# Altium project HighSpeedSoM_Project.PrjPcb
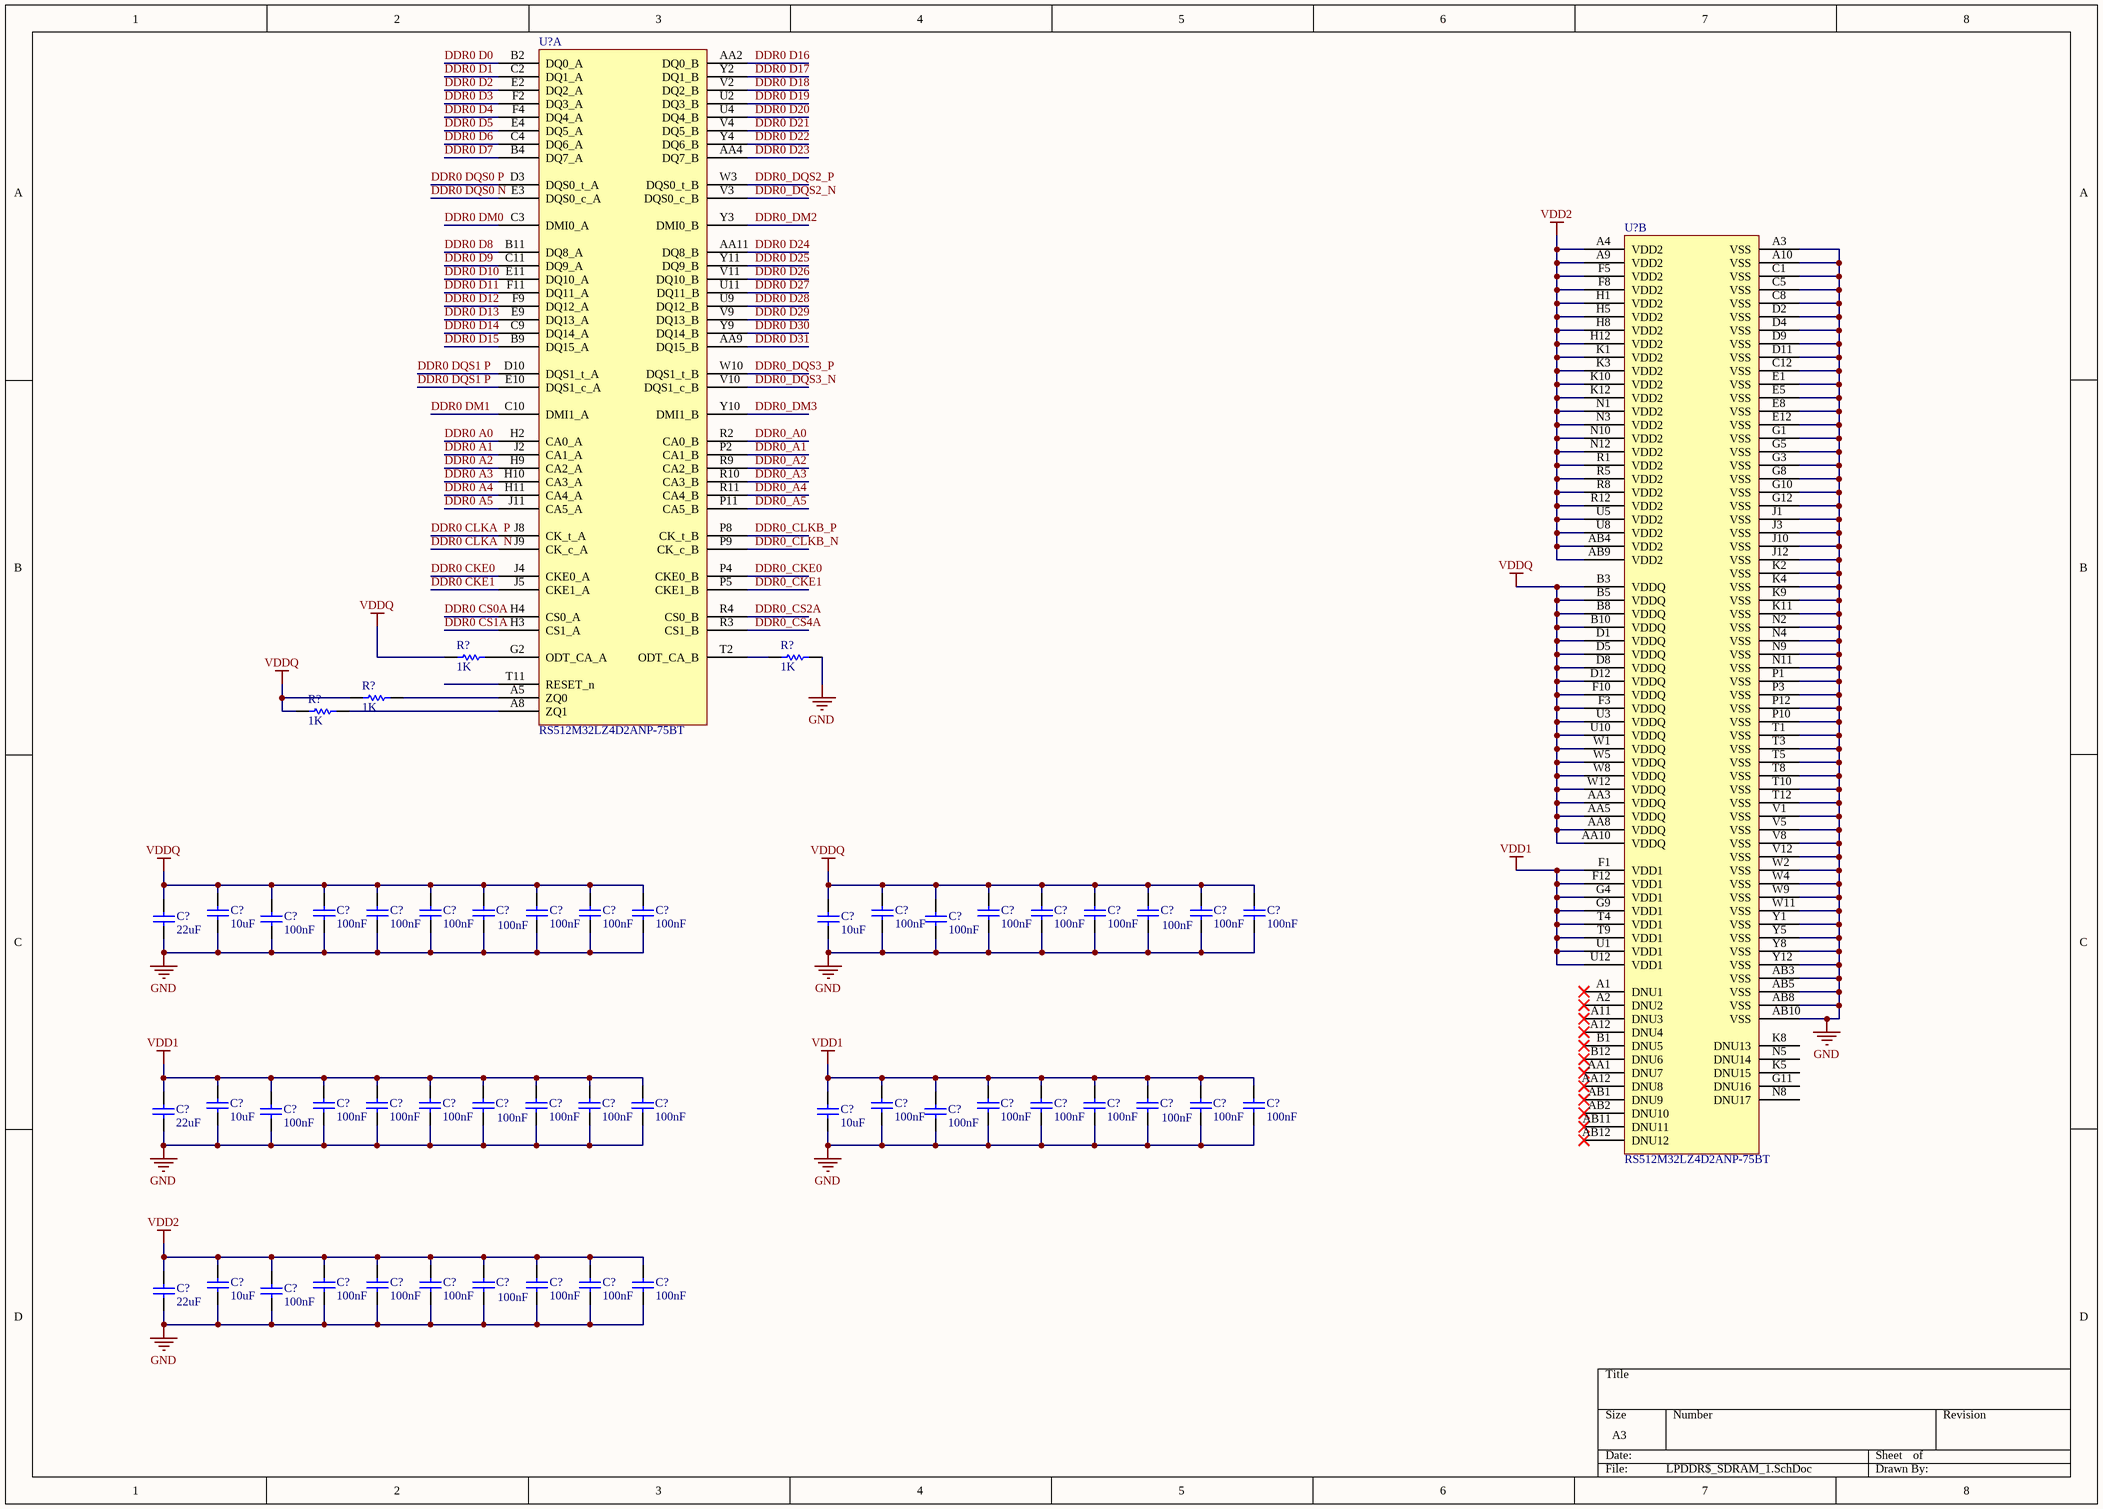
[diagram p0: LPDDR$_SDRAM_1.SchDoc]
3 sheets, 70 parts. Net scope: global (net labels, ports and power ports of the same name join across sheets).
Sheets:
  LPDDR$_SDRAM_1.SchDoc
  RK3399 SDRAM Page.SchDoc
  Block Diagram of SOM.SchDoc

## Sheet LPDDR$_SDRAM_1.SchDoc
size A3; SheetNumber: 1; SheetTotal: 6

### Parts
(Parts that share a designator on the sheet are numbered #1, #2 ... from top to bottom, then left to right.)
C?#1  value 10uF  (hidden comment: Capacitor)
C?#2  value 100nF  (hidden comment: Capacitor)
C?#3  value 100nF  (hidden comment: Capacitor)
C?#4  value 100nF  (hidden comment: Capacitor)
C?#5  value 100nF  (hidden comment: Capacitor)
C?#6  value 100nF  (hidden comment: Capacitor)
C?#7  value 100nF  (hidden comment: Capacitor)
C?#8  value 100nF  (hidden comment: Capacitor)
C?#9  value 100nF  (hidden comment: Capacitor)
C?#10  value 100nF  (hidden comment: Capacitor)
C?#11  value 100nF  (hidden comment: Capacitor)
C?#12  value 100nF  (hidden comment: Capacitor)
C?#13  value 100nF  (hidden comment: Capacitor)
C?#14  value 100nF  (hidden comment: Capacitor)
C?#15  value 100nF  (hidden comment: Capacitor)
C?#16  value 22uF  (hidden comment: Capacitor)
C?#17  value 100nF  (hidden comment: Capacitor)
C?#18  value 10uF  (hidden comment: Capacitor)
C?#19  value 100nF  (hidden comment: Capacitor)
C?#20  value 10uF  (hidden comment: Capacitor)
C?#21  value 100nF  (hidden comment: Capacitor)
C?#22  value 100nF  (hidden comment: Capacitor)
C?#23  value 100nF  (hidden comment: Capacitor)
C?#24  value 100nF  (hidden comment: Capacitor)
C?#25  value 100nF  (hidden comment: Capacitor)
C?#26  value 100nF  (hidden comment: Capacitor)
C?#27  value 100nF  (hidden comment: Capacitor)
C?#28  value 100nF  (hidden comment: Capacitor)
C?#29  value 100nF  (hidden comment: Capacitor)
C?#30  value 100nF  (hidden comment: Capacitor)
C?#31  value 100nF  (hidden comment: Capacitor)
C?#32  value 100nF  (hidden comment: Capacitor)
C?#33  value 100nF  (hidden comment: Capacitor)
C?#34  value 100nF  (hidden comment: Capacitor)
C?#35  value 22uF  (hidden comment: Capacitor)
C?#36  value 100nF  (hidden comment: Capacitor)
C?#37  value 10uF  (hidden comment: Capacitor)
C?#38  value 100nF  (hidden comment: Capacitor)
C?#39  value 22uF  (hidden comment: Capacitor)
C?#40  value 10uF  (hidden comment: Capacitor)
C?#41  value 100nF  (hidden comment: Capacitor)
C?#42  value 100nF  (hidden comment: Capacitor)
C?#43  value 100nF  (hidden comment: Capacitor)
C?#44  value 100nF  (hidden comment: Capacitor)
C?#45  value 100nF  (hidden comment: Capacitor)
C?#46  value 100nF  (hidden comment: Capacitor)
C?#47  value 100nF  (hidden comment: Capacitor)
C?#48  value 100nF  (hidden comment: Capacitor)
R?#1  value 1K  (hidden comment: Resistor)
R?#2  value 1K  (hidden comment: Resistor)
R?#3  value 1K  (hidden comment: Resistor)
R?#4  value 1K  (hidden comment: Resistor)
U?#1  RS512M32LZ4D2ANP-75BT  [FBGA200_SMD]  (part A of 2)
U?#2  RS512M32LZ4D2ANP-75BT  [FBGA200_SMD]  (part B of 2)

### Nets
GND: C?#1.1 C?#2.1 C?#3.1 C?#4.1 C?#5.1 C?#6.1 C?#7.1 C?#8.1 C?#9.1 C?#10.1 C?#11.1 C?#12.1 C?#13.1 C?#14.1 C?#15.1 C?#16.1 C?#17.1 C?#18.1 C?#19.1 C?#20.1 C?#21.1 C?#22.1 C?#23.1 C?#24.1 C?#25.1 C?#26.1 C?#27.1 C?#28.1 C?#29.1 C?#30.1 C?#31.1 C?#32.1 C?#33.1 C?#34.1 C?#35.1 C?#36.1 C?#37.1 C?#38.1 C?#39.1 C?#40.1 C?#41.1 C?#42.1 C?#43.1 C?#44.1 C?#45.1 C?#46.1 C?#47.1 C?#48.1 R?#2.2 U?#2.A3(VSS) U?#2.A10(VSS) U?#2.AB3(VSS) U?#2.AB5(VSS) U?#2.AB8(VSS) U?#2.AB10(VSS) U?#2.C1(VSS) U?#2.C5(VSS) U?#2.C8(VSS) U?#2.C12(VSS) U?#2.D2(VSS) U?#2.D4(VSS) U?#2.D9(VSS) U?#2.D11(VSS) U?#2.E1(VSS) U?#2.E5(VSS) U?#2.E8(VSS) U?#2.E12(VSS) U?#2.G1(VSS) U?#2.G3(VSS) U?#2.G5(VSS) U?#2.G8(VSS) U?#2.G10(VSS) U?#2.G12(VSS) U?#2.J1(VSS) U?#2.J3(VSS) U?#2.J10(VSS) U?#2.J12(VSS) U?#2.K2(VSS) U?#2.K4(VSS) U?#2.K9(VSS) U?#2.K11(VSS) U?#2.N2(VSS) U?#2.N4(VSS) U?#2.N9(VSS) U?#2.N11(VSS) U?#2.P1(VSS) U?#2.P3(VSS) U?#2.P10(VSS) U?#2.P12(VSS) U?#2.T1(VSS) U?#2.T3(VSS) U?#2.T5(VSS) U?#2.T8(VSS) U?#2.T10(VSS) U?#2.T12(VSS) U?#2.V1(VSS) U?#2.V5(VSS) U?#2.V8(VSS) U?#2.V12(VSS) U?#2.W2(VSS) U?#2.W4(VSS) U?#2.W9(VSS) U?#2.W11(VSS) U?#2.Y1(VSS) U?#2.Y5(VSS) U?#2.Y8(VSS) U?#2.Y12(VSS)
VDD1: C?#20.2 C?#21.2 C?#22.2 C?#23.2 C?#24.2 C?#25.2 C?#26.2 C?#27.2 C?#28.2 C?#29.2 C?#30.2 C?#31.2 C?#32.2 C?#33.2 C?#34.2 C?#35.2 C?#36.2 C?#37.2 C?#38.2 U?#2.F1(VDD1) U?#2.F12(VDD1) U?#2.G4(VDD1) U?#2.G9(VDD1) U?#2.T4(VDD1) U?#2.T9(VDD1) U?#2.U1(VDD1) U?#2.U12(VDD1)
VDD2: C?#39.2 C?#40.2 C?#41.2 C?#42.2 C?#43.2 C?#44.2 C?#45.2 C?#46.2 C?#47.2 C?#48.2 U?#2.A4(VDD2) U?#2.A9(VDD2) U?#2.AB4(VDD2) U?#2.AB9(VDD2) U?#2.F5(VDD2) U?#2.F8(VDD2) U?#2.H1(VDD2) U?#2.H5(VDD2) U?#2.H8(VDD2) U?#2.H12(VDD2) U?#2.K1(VDD2) U?#2.K3(VDD2) U?#2.K10(VDD2) U?#2.K12(VDD2) U?#2.N1(VDD2) U?#2.N3(VDD2) U?#2.N10(VDD2) U?#2.N12(VDD2) U?#2.R1(VDD2) U?#2.R5(VDD2) U?#2.R8(VDD2) U?#2.R12(VDD2) U?#2.U5(VDD2) U?#2.U8(VDD2)
VDDQ: C?#1.2 C?#2.2 C?#3.2 C?#4.2 C?#5.2 C?#6.2 C?#7.2 C?#8.2 C?#9.2 C?#10.2 C?#11.2 C?#12.2 C?#13.2 C?#14.2 C?#15.2 C?#16.2 C?#17.2 C?#18.2 C?#19.2 R?#1.1 R?#3.1 R?#4.1 U?#2.AA3(VDDQ) U?#2.AA5(VDDQ) U?#2.AA8(VDDQ) U?#2.AA10(VDDQ) U?#2.B3(VDDQ) U?#2.B5(VDDQ) U?#2.B8(VDDQ) U?#2.B10(VDDQ) U?#2.D1(VDDQ) U?#2.D5(VDDQ) U?#2.D8(VDDQ) U?#2.D12(VDDQ) U?#2.F3(VDDQ) U?#2.F10(VDDQ) U?#2.U3(VDDQ) U?#2.U10(VDDQ) U?#2.W1(VDDQ) U?#2.W5(VDDQ) U?#2.W8(VDDQ) U?#2.W12(VDDQ)
DDR0 A0: U?#1.H2(CA0_A)
DDR0 A1: U?#1.J2(CA1_A)
DDR0 A2: U?#1.H9(CA2_A)
DDR0 A3: U?#1.H10(CA3_A)
DDR0 A4: U?#1.H11(CA4_A)
DDR0 A5: U?#1.J11(CA5_A)
DDR0 CKE0: U?#1.J4(CKE0_A)
DDR0 CKE1: U?#1.J5(CKE1_A)
DDR0 CLKA  N: U?#1.J9(CK_c_A)
DDR0 CLKA  P: U?#1.J8(CK_t_A)
DDR0 CS0A: U?#1.H4(CS0_A)
DDR0 CS1A: U?#1.H3(CS1_A)
DDR0 D0: U?#1.B2(DQ0_A)
DDR0 D1: U?#1.C2(DQ1_A)
DDR0 D2: U?#1.E2(DQ2_A)
DDR0 D3: U?#1.F2(DQ3_A)
DDR0 D4: U?#1.F4(DQ4_A)
DDR0 D5: U?#1.E4(DQ5_A)
DDR0 D6: U?#1.C4(DQ6_A)
DDR0 D7: U?#1.B4(DQ7_A)
DDR0 D8: U?#1.B11(DQ8_A)
DDR0 D9: U?#1.C11(DQ9_A)
DDR0 D10: U?#1.E11(DQ10_A)
DDR0 D11: U?#1.F11(DQ11_A)
DDR0 D12: U?#1.F9(DQ12_A)
DDR0 D13: U?#1.E9(DQ13_A)
DDR0 D14: U?#1.C9(DQ14_A)
DDR0 D15: U?#1.B9(DQ15_A)
DDR0 D16: U?#1.AA2(DQ0_B)
DDR0 D17: U?#1.Y2(DQ1_B)
DDR0 D18: U?#1.V2(DQ2_B)
DDR0 D19: U?#1.U2(DQ3_B)
DDR0 D20: U?#1.U4(DQ4_B)
DDR0 D21: U?#1.V4(DQ5_B)
DDR0 D22: U?#1.Y4(DQ6_B)
DDR0 D23: U?#1.AA4(DQ7_B)
DDR0 D24: U?#1.AA11(DQ8_B)
DDR0 D25: U?#1.Y11(DQ9_B)
DDR0 D26: U?#1.V11(DQ10_B)
DDR0 D27: U?#1.U11(DQ11_B)
DDR0 D28: U?#1.U9(DQ12_B)
DDR0 D29: U?#1.V9(DQ13_B)
DDR0 D30: U?#1.Y9(DQ14_B)
DDR0 D31: U?#1.AA9(DQ15_B)
DDR0 DM0: U?#1.C3(DMI0_A)
DDR0 DM1: U?#1.C10(DMI1_A)
DDR0 DQS0 N: U?#1.E3(DQS0_c_A)
DDR0 DQS0 P: U?#1.D3(DQS0_t_A)
DDR0 DQS1 P: U?#1.D10(DQS1_t_A) U?#1.E10(DQS1_c_A)
DDR0_A0: U?#1.R2(CA0_B)
DDR0_A1: U?#1.P2(CA1_B)
DDR0_A2: U?#1.R9(CA2_B)
DDR0_A3: U?#1.R10(CA3_B)
DDR0_A4: U?#1.R11(CA4_B)
DDR0_A5: U?#1.P11(CA5_B)
DDR0_CKE0: U?#1.P4(CKE0_B)
DDR0_CKE1: U?#1.P5(CKE1_B)
DDR0_CLKB_N: U?#1.P9(CK_c_B)
DDR0_CLKB_P: U?#1.P8(CK_t_B)
DDR0_CS2A: U?#1.R4(CS0_B)
DDR0_CS4A: U?#1.R3(CS1_B)
DDR0_DM2: U?#1.Y3(DMI0_B)
DDR0_DM3: U?#1.Y10(DMI1_B)
DDR0_DQS2_N: U?#1.V3(DQS0_c_B)
DDR0_DQS2_P: U?#1.W3(DQS0_t_B)
DDR0_DQS3_N: U?#1.V10(DQS1_c_B)
DDR0_DQS3_P: U?#1.W10(DQS1_t_B)
NetR?#1_2: R?#1.2 U?#1.G2(ODT_CA_A)
NetR?#2_1: R?#2.1 U?#1.T2(ODT_CA_B)
NetR?#3_2: R?#3.2 U?#1.A5(ZQ0)
NetR?#4_2: R?#4.2 U?#1.A8(ZQ1)

Not connected (* = marked no-connect by the designer): U?#1 T11(RESET_n); U?#2 A1(DNU1)* A2(DNU2)* A11(DNU3)* A12(DNU4)* AA1(DNU7)* AA12(DNU8)* AB1(DNU9)* AB2(DNU10)* AB11(DNU11)* AB12(DNU12)* B1(DNU5)* B12(DNU6)* G11(DNU16) K5(DNU15) K8(DNU13) N5(DNU14) N8(DNU17)

### Library data of the parts
C?#1-C?#48 = Capacitor: SimulationGenericComponent: True
R?#1-R?#4 = Resistor: TC1: 0; SimulationGenericComponent: True; TC2: 0
U?#1 U?#2 = IC_RS512M32LZ4D2ANP-75BT: LPDDR4/4X Package FBGA 200b Density 4Gbit~64Gbit Operating Temperature Range：-25~85℃ Speed：2667Mbps/3200Mbps/3733Mbps Voltage：VDD1/VDD2/VDDQ= 1.8 / 1.1 / 1.1 V（LPDDR4）VDD1/VDD2/VDDQ = 1.8 / 1.1 / 0.6 V（LPDDR4X）Approved Verification Platform：MTK、Spreadtrum; Manufacturer: RAYSON; Manufacturer Part Number: RS512M32LZ4D2ANP-75BT; Case/Package: FBGA 200b; Supplier-1: RAYSON

## Sheet RK3399 SDRAM Page.SchDoc
size A3; SheetNumber: 6; SheetTotal: 7
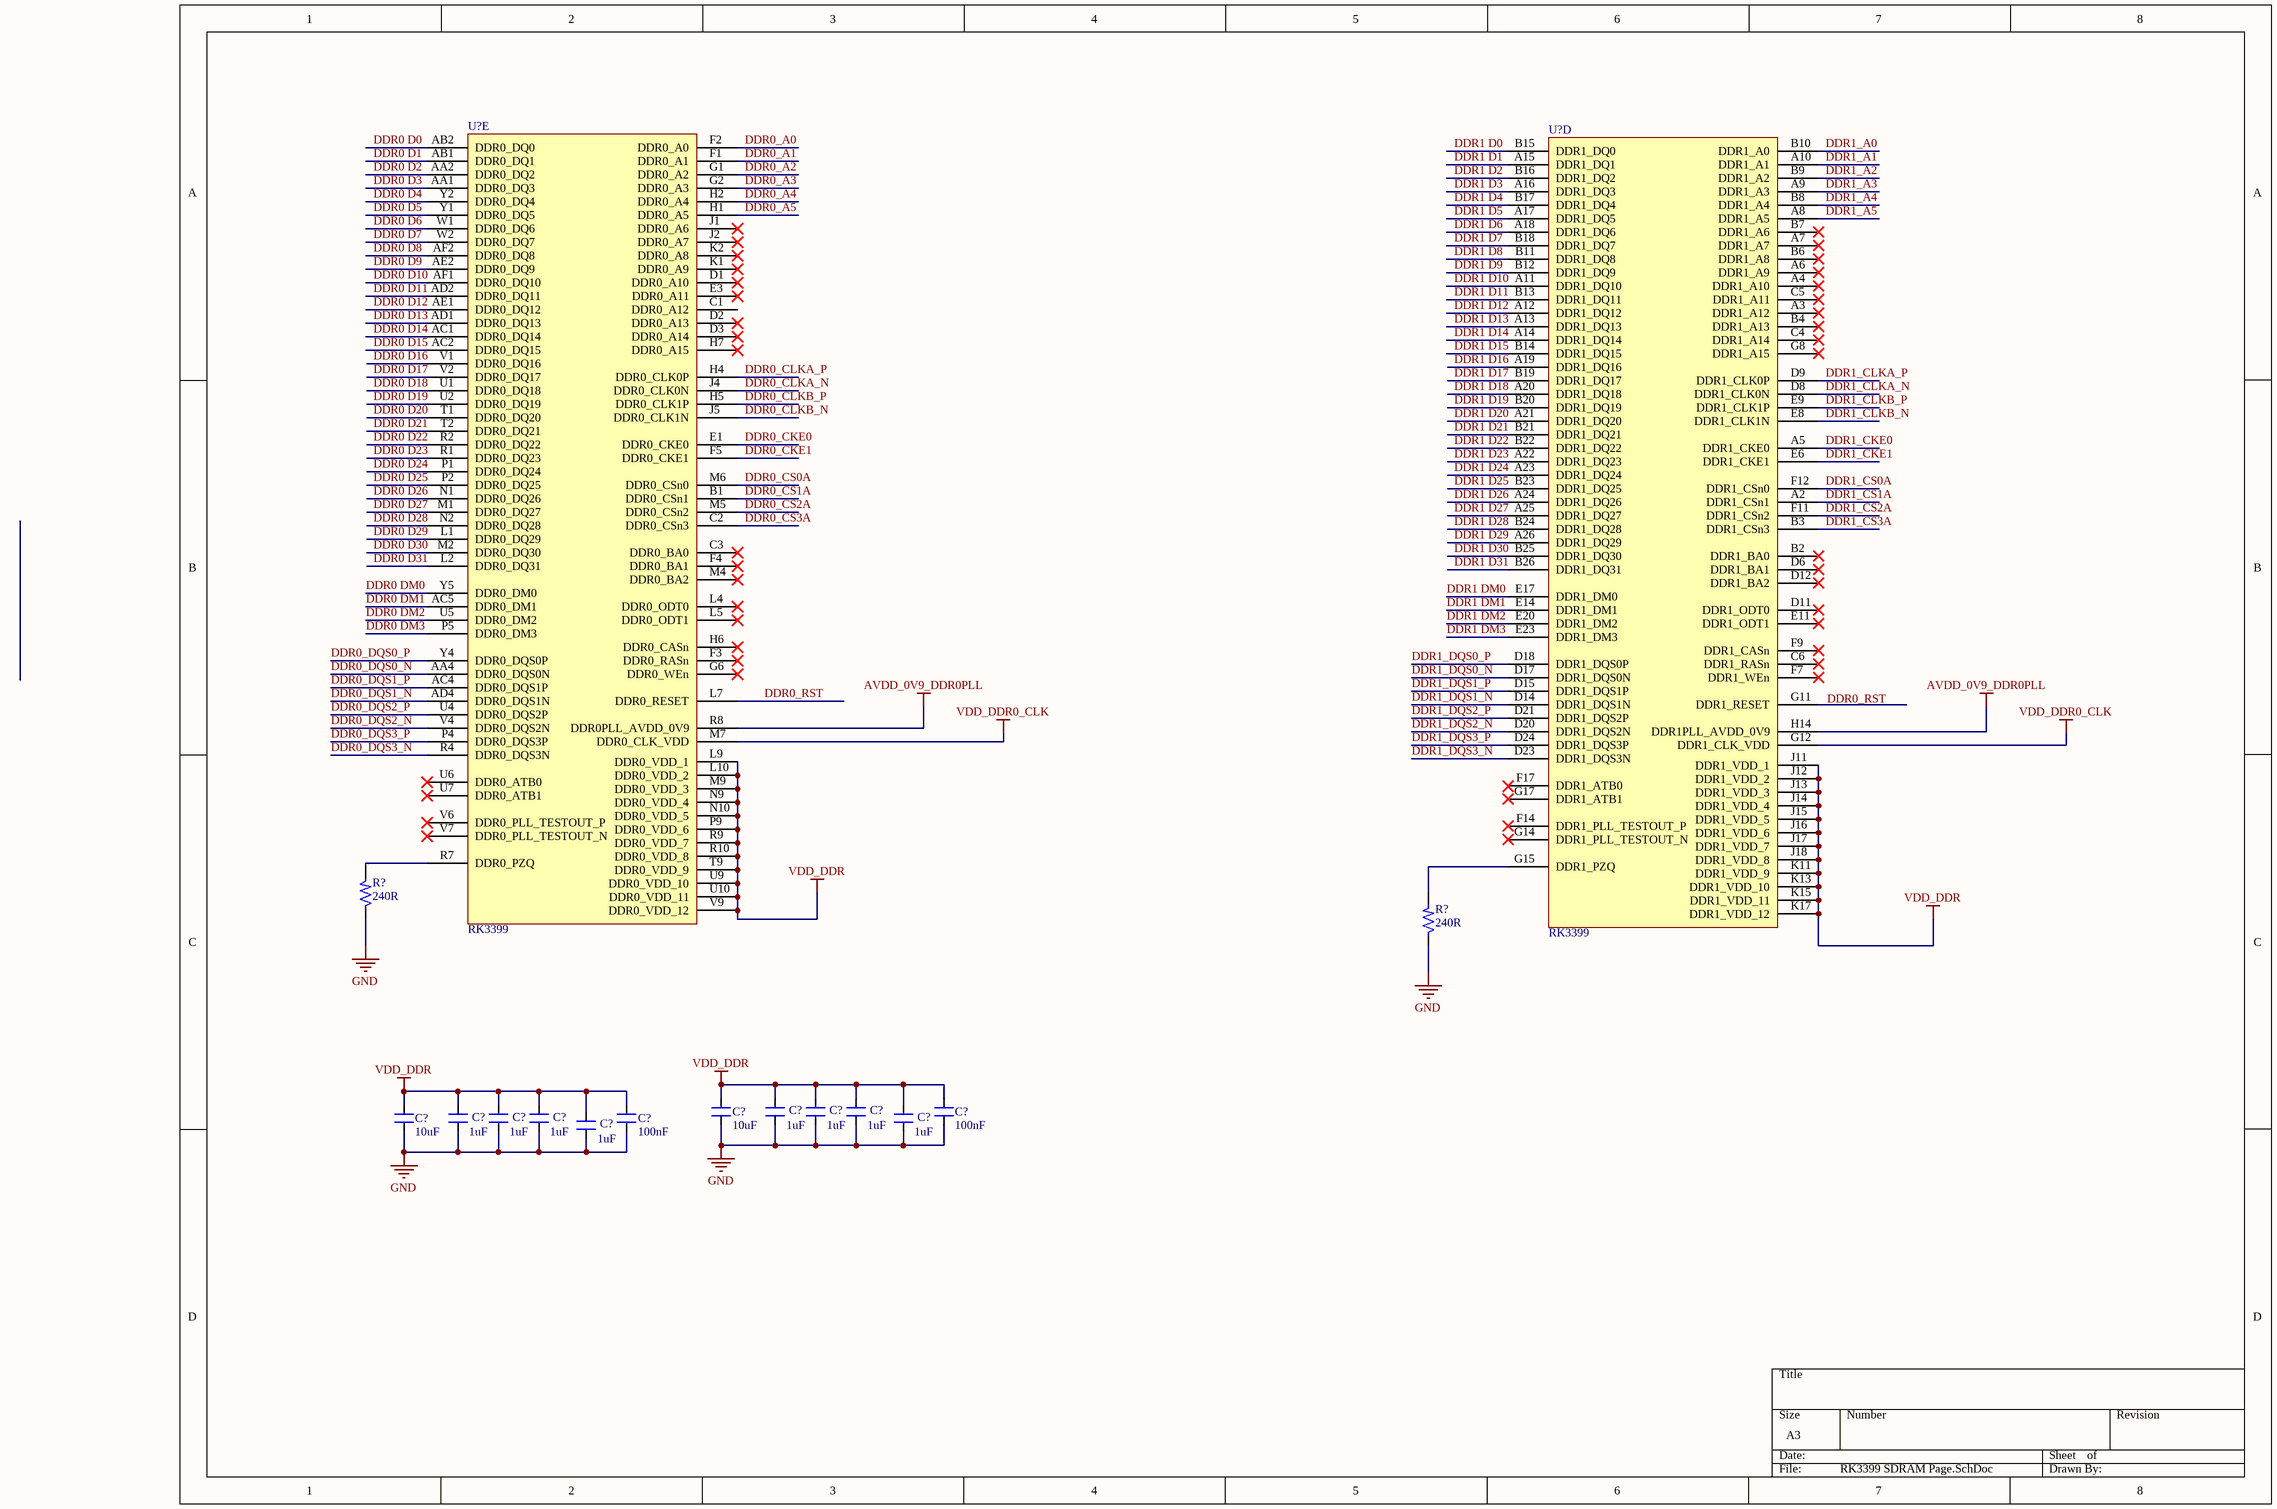
[diagram p1: RK3399 SDRAM Page.SchDoc]

### Parts
(Parts that share a designator on the sheet are numbered #1, #2 ... from top to bottom, then left to right.)
C?#49  10uF  [CAP_0603]
C?#50  1uF  [CAP_0402]
C?#51  1uF  [CAP_0402]
C?#52  1uF  [CAP_0402]
C?#53  100nF  [CAP_0201]
C?#54  10uF  [CAP_0603]
C?#55  1uF  [CAP_0402]
C?#56  1uF  [CAP_0402]
C?#57  1uF  [CAP_0402]
C?#58  100nF  [CAP_0201]
C?#59  1uF  [CAP_0402]
C?#60  1uF  [CAP_0402]
R?#5  240R  [RES_0402]
R?#6  240R  [RES_0402]
U?#3  RK3399  [FBGA828_23_826X826]  (part E of 24)
U?#4  RK3399  [FBGA828_23_826X826]  (part D of 24)

### Nets
AVDD_0V9_DDR0PLL: U?#3.R8(DDR0PLL_AVDD_0V9) U?#4.H14(DDR1PLL_AVDD_0V9)
GND: C?#49.1 C?#50.1 C?#51.1 C?#52.1 C?#53.1 C?#54.1 C?#55.1 C?#56.1 C?#57.1 C?#58.1 C?#59.1 C?#60.1 R?#5.1 R?#6.1
VDD_DDR: C?#49.2 C?#50.2 C?#51.2 C?#52.2 C?#53.2 C?#54.2 C?#55.2 C?#56.2 C?#57.2 C?#58.2 C?#59.2 C?#60.2 U?#3.L9(DDR0_VDD_1) U?#3.L10(DDR0_VDD_2) U?#3.M9(DDR0_VDD_3) U?#3.N9(DDR0_VDD_4) U?#3.N10(DDR0_VDD_5) U?#3.P9(DDR0_VDD_6) U?#3.R9(DDR0_VDD_7) U?#3.R10(DDR0_VDD_8) U?#3.T9(DDR0_VDD_9) U?#3.U9(DDR0_VDD_10) U?#3.U10(DDR0_VDD_11) U?#3.V9(DDR0_VDD_12) U?#4.J11(DDR1_VDD_1) U?#4.J12(DDR1_VDD_2) U?#4.J13(DDR1_VDD_3) U?#4.J14(DDR1_VDD_4) U?#4.J15(DDR1_VDD_5) U?#4.J16(DDR1_VDD_6) U?#4.J17(DDR1_VDD_7) U?#4.J18(DDR1_VDD_8) U?#4.K11(DDR1_VDD_9) U?#4.K13(DDR1_VDD_10) U?#4.K15(DDR1_VDD_11) U?#4.K17(DDR1_VDD_12)
VDD_DDR0_CLK: U?#3.M7(DDR0_CLK_VDD) U?#4.G12(DDR1_CLK_VDD)
DDR0 D0: U?#3.AB2(DDR0_DQ0)
DDR0 D1: U?#3.AB1(DDR0_DQ1)
DDR0 D2: U?#3.AA2(DDR0_DQ2)
DDR0 D3: U?#3.AA1(DDR0_DQ3)
DDR0 D4: U?#3.Y2(DDR0_DQ4)
DDR0 D5: U?#3.Y1(DDR0_DQ5)
DDR0 D6: U?#3.W1(DDR0_DQ6)
DDR0 D7: U?#3.W2(DDR0_DQ7)
DDR0 D8: U?#3.AF2(DDR0_DQ8)
DDR0 D9: U?#3.AE2(DDR0_DQ9)
DDR0 D10: U?#3.AF1(DDR0_DQ10)
DDR0 D11: U?#3.AD2(DDR0_DQ11)
DDR0 D12: U?#3.AE1(DDR0_DQ12)
DDR0 D13: U?#3.AD1(DDR0_DQ13)
DDR0 D14: U?#3.AC1(DDR0_DQ14)
DDR0 D15: U?#3.AC2(DDR0_DQ15)
DDR0 D16: U?#3.V1(DDR0_DQ16)
DDR0 D17: U?#3.V2(DDR0_DQ17)
DDR0 D18: U?#3.U1(DDR0_DQ18)
DDR0 D19: U?#3.U2(DDR0_DQ19)
DDR0 D20: U?#3.T1(DDR0_DQ20)
DDR0 D21: U?#3.T2(DDR0_DQ21)
DDR0 D22: U?#3.R2(DDR0_DQ22)
DDR0 D23: U?#3.R1(DDR0_DQ23)
DDR0 D24: U?#3.P1(DDR0_DQ24)
DDR0 D25: U?#3.P2(DDR0_DQ25)
DDR0 D26: U?#3.N1(DDR0_DQ26)
DDR0 D27: U?#3.M1(DDR0_DQ27)
DDR0 D28: U?#3.N2(DDR0_DQ28)
DDR0 D29: U?#3.L1(DDR0_DQ29)
DDR0 D30: U?#3.M2(DDR0_DQ30)
DDR0 D31: U?#3.L2(DDR0_DQ31)
DDR0 DM0: U?#3.Y5(DDR0_DM0)
DDR0 DM1: U?#3.AC5(DDR0_DM1)
DDR0 DM2: U?#3.U5(DDR0_DM2)
DDR0 DM3: U?#3.P5(DDR0_DM3)
DDR0_A0: U?#3.F2(DDR0_A0)
DDR0_A1: U?#3.F1(DDR0_A1)
DDR0_A2: U?#3.G1(DDR0_A2)
DDR0_A3: U?#3.G2(DDR0_A3)
DDR0_A4: U?#3.H2(DDR0_A4)
DDR0_A5: U?#3.H1(DDR0_A5)
DDR0_CKE0: U?#3.E1(DDR0_CKE0)
DDR0_CKE1: U?#3.F5(DDR0_CKE1)
DDR0_CLKA_N: U?#3.J4(DDR0_CLK0N)
DDR0_CLKA_P: U?#3.H4(DDR0_CLK0P)
DDR0_CLKB_N: U?#3.J5(DDR0_CLK1N)
DDR0_CLKB_P: U?#3.H5(DDR0_CLK1P)
DDR0_CS0A: U?#3.M6(DDR0_CSn0)
DDR0_CS1A: U?#3.B1(DDR0_CSn1)
DDR0_CS2A: U?#3.M5(DDR0_CSn2)
DDR0_CS3A: U?#3.C2(DDR0_CSn3)
DDR0_DQS0_N: U?#3.AA4(DDR0_DQS0N)
DDR0_DQS0_P: U?#3.Y4(DDR0_DQS0P)
DDR0_DQS1_N: U?#3.AD4(DDR0_DQS1N)
DDR0_DQS1_P: U?#3.AC4(DDR0_DQS1P)
DDR0_DQS2_N: U?#3.V4(DDR0_DQS2N)
DDR0_DQS2_P: U?#3.U4(DDR0_DQS2P)
DDR0_DQS3_N: U?#3.R4(DDR0_DQS3N)
DDR0_DQS3_P: U?#3.P4(DDR0_DQS3P)
DDR0_RST: U?#3.L7(DDR0_RESET)
DDR1 D0: U?#4.B15(DDR1_DQ0)
DDR1 D1: U?#4.A15(DDR1_DQ1)
DDR1 D2: U?#4.B16(DDR1_DQ2)
DDR1 D3: U?#4.A16(DDR1_DQ3)
DDR1 D4: U?#4.B17(DDR1_DQ4)
DDR1 D5: U?#4.A17(DDR1_DQ5)
DDR1 D6: U?#4.A18(DDR1_DQ6)
DDR1 D7: U?#4.B18(DDR1_DQ7)
DDR1 D8: U?#4.B11(DDR1_DQ8)
DDR1 D9: U?#4.B12(DDR1_DQ9)
DDR1 D10: U?#4.A11(DDR1_DQ10)
DDR1 D11: U?#4.B13(DDR1_DQ11)
DDR1 D12: U?#4.A12(DDR1_DQ12)
DDR1 D13: U?#4.A13(DDR1_DQ13)
DDR1 D14: U?#4.A14(DDR1_DQ14)
DDR1 D15: U?#4.B14(DDR1_DQ15)
DDR1 D16: U?#4.A19(DDR1_DQ16)
DDR1 D17: U?#4.B19(DDR1_DQ17)
DDR1 D18: U?#4.A20(DDR1_DQ18)
DDR1 D19: U?#4.B20(DDR1_DQ19)
DDR1 D20: U?#4.A21(DDR1_DQ20)
DDR1 D21: U?#4.B21(DDR1_DQ21)
DDR1 D22: U?#4.B22(DDR1_DQ22)
DDR1 D23: U?#4.A22(DDR1_DQ23)
DDR1 D24: U?#4.A23(DDR1_DQ24)
DDR1 D25: U?#4.B23(DDR1_DQ25)
DDR1 D26: U?#4.A24(DDR1_DQ26)
DDR1 D27: U?#4.A25(DDR1_DQ27)
DDR1 D28: U?#4.B24(DDR1_DQ28)
DDR1 D29: U?#4.A26(DDR1_DQ29)
DDR1 D30: U?#4.B25(DDR1_DQ30)
DDR1 D31: U?#4.B26(DDR1_DQ31)
DDR1 DM0: U?#4.E17(DDR1_DM0)
DDR1 DM1: U?#4.E14(DDR1_DM1)
DDR1 DM2: U?#4.E20(DDR1_DM2)
DDR1 DM3: U?#4.E23(DDR1_DM3)
DDR1_A0: U?#4.B10(DDR1_A0)
DDR1_A1: U?#4.A10(DDR1_A1)
DDR1_A2: U?#4.B9(DDR1_A2)
DDR1_A3: U?#4.A9(DDR1_A3)
DDR1_A4: U?#4.B8(DDR1_A4)
DDR1_A5: U?#4.A8(DDR1_A5)
DDR1_CKE0: U?#4.A5(DDR1_CKE0)
DDR1_CKE1: U?#4.E6(DDR1_CKE1)
DDR1_CLKA_N: U?#4.D8(DDR1_CLK0N)
DDR1_CLKA_P: U?#4.D9(DDR1_CLK0P)
DDR1_CLKB_N: U?#4.E8(DDR1_CLK1N)
DDR1_CLKB_P: U?#4.E9(DDR1_CLK1P)
DDR1_CS0A: U?#4.F12(DDR1_CSn0)
DDR1_CS1A: U?#4.A2(DDR1_CSn1)
DDR1_CS2A: U?#4.F11(DDR1_CSn2)
DDR1_CS3A: U?#4.B3(DDR1_CSn3)
DDR1_DQS0_N: U?#4.D17(DDR1_DQS0N)
DDR1_DQS0_P: U?#4.D18(DDR1_DQS0P)
DDR1_DQS1_N: U?#4.D14(DDR1_DQS1N)
DDR1_DQS1_P: U?#4.D15(DDR1_DQS1P)
DDR1_DQS2_N: U?#4.D20(DDR1_DQS2N)
DDR1_DQS2_P: U?#4.D21(DDR1_DQS2P)
DDR1_DQS3_N: U?#4.D23(DDR1_DQS3N)
DDR1_DQS3_P: U?#4.D24(DDR1_DQS3P)
NetR?#5_2: R?#5.2 U?#3.R7(DDR0_PZQ)
NetR?#6_2: R?#6.2 U?#4.G15(DDR1_PZQ)

Not connected (* = marked no-connect by the designer): U?#3 C1(DDR0_A12) C3(DDR0_BA0)* D1(DDR0_A10)* D2(DDR0_A13)* D3(DDR0_A14)* E3(DDR0_A11)* F3(DDR0_RASn)* F4(DDR0_BA1)* G6(DDR0_WEn)* H6(DDR0_CASn)* H7(DDR0_A15)* J1(DDR0_A6)* J2(DDR0_A7)* K1(DDR0_A9)* K2(DDR0_A8)* L4(DDR0_ODT0)* L5(DDR0_ODT1)* M4(DDR0_BA2)* U6(DDR0_ATB0)* U7(DDR0_ATB1)* V6(DDR0_PLL_TESTOUT_P)* V7(DDR0_PLL_TESTOUT_N)*; U?#4 A3(DDR1_A12)* A4(DDR1_A10)* A6(DDR1_A9)* A7(DDR1_A7)* B2(DDR1_BA0)* B4(DDR1_A13)* B6(DDR1_A8)* B7(DDR1_A6)* C4(DDR1_A14)* C5(DDR1_A11)* C6(DDR1_RASn)* D6(DDR1_BA1)* D11(DDR1_ODT0)* D12(DDR1_BA2)* E11(DDR1_ODT1)* F7(DDR1_WEn)* F9(DDR1_CASn)* F14(DDR1_PLL_TESTOUT_P)* F17(DDR1_ATB0) G8(DDR1_A15)* G11(DDR1_RESET) G14(DDR1_PLL_TESTOUT_N)* G17(DDR1_ATB1)*

### Notes on the sheet
- Labels drawn without touching a wire or pin: DDR0_RST

### Library data of the parts
C?#49 C?#54 = CAP_10uF-10V-10%-0603: 10µF ±10% 10V Ceramic Capacitor X5R 0603 (1608 Metric); Manufacturer Part Number: GRM188R61A106KE69J; Manufacturer: Murata Electronics; Case/Package: 0603; Supplier-1: Digikey
C?#50-C?#52 C?#55-C?#57 C?#59 C?#60 = CAP_1uF-10V-10%-0402: 1µF ±10% 10V Ceramic Capacitor X6S 0402 (1005 Metric); Manufacturer: Murata Electronics; Manufacturer Part Number: GRT155C81A105KE01D; Case/Package: 0402; Supplier-1: Digikey
C?#53 C?#58 = CAP_100nF-25V-10%-0201: 0.1µF ±10% 25V Ceramic Capacitor X5R 0201 (0603 Metric); Manufacturer: TDK Corporation; Manufacturer Part Number: C0603X5R1E104K030BB; Case/Package: 0201; Supplier-1: Digikey
R?#5 R?#6 = RES_240R-0.1W-1%-0402: 240 Ohms ±1% 0.1W, 1/10W Chip Resistor 0402 (1005 Metric) Automotive AEC-Q200 Thick Film; Manufacturer: Panasonic Electronic Components; Manufacturer Part Number: ERJ-2RKF2400X; Case/Package: 0402; Supplier-1: Digikey
U?#3 U?#4 = IC_RK3399-FCBGA828: RK3399 is a low power, high performance processor for computing, personal mobile.; Manufacturer: Rockchip; Manufacturer Part Number: RK3399; Case/Package: FCBGA828; Supplier-1: Rockchip

## Sheet Block Diagram of SOM.SchDoc
size A3; SheetNumber: 7; SheetTotal: 7

## Nets that join several sheets
GND: LPDDR$_SDRAM_1 (107 pins), RK3399 SDRAM Page (14 pins)
DDR0 D0: LPDDR$_SDRAM_1 (U?#1.B2), RK3399 SDRAM Page (U?#3.AB2)
DDR0 D1: LPDDR$_SDRAM_1 (U?#1.C2), RK3399 SDRAM Page (U?#3.AB1)
DDR0 D2: LPDDR$_SDRAM_1 (U?#1.E2), RK3399 SDRAM Page (U?#3.AA2)
DDR0 D3: LPDDR$_SDRAM_1 (U?#1.F2), RK3399 SDRAM Page (U?#3.AA1)
DDR0 D4: LPDDR$_SDRAM_1 (U?#1.F4), RK3399 SDRAM Page (U?#3.Y2)
DDR0 D5: LPDDR$_SDRAM_1 (U?#1.E4), RK3399 SDRAM Page (U?#3.Y1)
DDR0 D6: LPDDR$_SDRAM_1 (U?#1.C4), RK3399 SDRAM Page (U?#3.W1)
DDR0 D7: LPDDR$_SDRAM_1 (U?#1.B4), RK3399 SDRAM Page (U?#3.W2)
DDR0 D8: LPDDR$_SDRAM_1 (U?#1.B11), RK3399 SDRAM Page (U?#3.AF2)
DDR0 D9: LPDDR$_SDRAM_1 (U?#1.C11), RK3399 SDRAM Page (U?#3.AE2)
DDR0 D10: LPDDR$_SDRAM_1 (U?#1.E11), RK3399 SDRAM Page (U?#3.AF1)
DDR0 D11: LPDDR$_SDRAM_1 (U?#1.F11), RK3399 SDRAM Page (U?#3.AD2)
DDR0 D12: LPDDR$_SDRAM_1 (U?#1.F9), RK3399 SDRAM Page (U?#3.AE1)
DDR0 D13: LPDDR$_SDRAM_1 (U?#1.E9), RK3399 SDRAM Page (U?#3.AD1)
DDR0 D14: LPDDR$_SDRAM_1 (U?#1.C9), RK3399 SDRAM Page (U?#3.AC1)
DDR0 D15: LPDDR$_SDRAM_1 (U?#1.B9), RK3399 SDRAM Page (U?#3.AC2)
DDR0 D16: LPDDR$_SDRAM_1 (U?#1.AA2), RK3399 SDRAM Page (U?#3.V1)
DDR0 D17: LPDDR$_SDRAM_1 (U?#1.Y2), RK3399 SDRAM Page (U?#3.V2)
DDR0 D18: LPDDR$_SDRAM_1 (U?#1.V2), RK3399 SDRAM Page (U?#3.U1)
DDR0 D19: LPDDR$_SDRAM_1 (U?#1.U2), RK3399 SDRAM Page (U?#3.U2)
DDR0 D20: LPDDR$_SDRAM_1 (U?#1.U4), RK3399 SDRAM Page (U?#3.T1)
DDR0 D21: LPDDR$_SDRAM_1 (U?#1.V4), RK3399 SDRAM Page (U?#3.T2)
DDR0 D22: LPDDR$_SDRAM_1 (U?#1.Y4), RK3399 SDRAM Page (U?#3.R2)
DDR0 D23: LPDDR$_SDRAM_1 (U?#1.AA4), RK3399 SDRAM Page (U?#3.R1)
DDR0 D24: LPDDR$_SDRAM_1 (U?#1.AA11), RK3399 SDRAM Page (U?#3.P1)
DDR0 D25: LPDDR$_SDRAM_1 (U?#1.Y11), RK3399 SDRAM Page (U?#3.P2)
DDR0 D26: LPDDR$_SDRAM_1 (U?#1.V11), RK3399 SDRAM Page (U?#3.N1)
DDR0 D27: LPDDR$_SDRAM_1 (U?#1.U11), RK3399 SDRAM Page (U?#3.M1)
DDR0 D28: LPDDR$_SDRAM_1 (U?#1.U9), RK3399 SDRAM Page (U?#3.N2)
DDR0 D29: LPDDR$_SDRAM_1 (U?#1.V9), RK3399 SDRAM Page (U?#3.L1)
DDR0 D30: LPDDR$_SDRAM_1 (U?#1.Y9), RK3399 SDRAM Page (U?#3.M2)
DDR0 D31: LPDDR$_SDRAM_1 (U?#1.AA9), RK3399 SDRAM Page (U?#3.L2)
DDR0 DM0: LPDDR$_SDRAM_1 (U?#1.C3), RK3399 SDRAM Page (U?#3.Y5)
DDR0 DM1: LPDDR$_SDRAM_1 (U?#1.C10), RK3399 SDRAM Page (U?#3.AC5)
DDR0_A0: LPDDR$_SDRAM_1 (U?#1.R2), RK3399 SDRAM Page (U?#3.F2)
DDR0_A1: LPDDR$_SDRAM_1 (U?#1.P2), RK3399 SDRAM Page (U?#3.F1)
DDR0_A2: LPDDR$_SDRAM_1 (U?#1.R9), RK3399 SDRAM Page (U?#3.G1)
DDR0_A3: LPDDR$_SDRAM_1 (U?#1.R10), RK3399 SDRAM Page (U?#3.G2)
DDR0_A4: LPDDR$_SDRAM_1 (U?#1.R11), RK3399 SDRAM Page (U?#3.H2)
DDR0_A5: LPDDR$_SDRAM_1 (U?#1.P11), RK3399 SDRAM Page (U?#3.H1)
DDR0_CKE0: LPDDR$_SDRAM_1 (U?#1.P4), RK3399 SDRAM Page (U?#3.E1)
DDR0_CKE1: LPDDR$_SDRAM_1 (U?#1.P5), RK3399 SDRAM Page (U?#3.F5)
DDR0_CLKB_N: LPDDR$_SDRAM_1 (U?#1.P9), RK3399 SDRAM Page (U?#3.J5)
DDR0_CLKB_P: LPDDR$_SDRAM_1 (U?#1.P8), RK3399 SDRAM Page (U?#3.H5)
DDR0_CS2A: LPDDR$_SDRAM_1 (U?#1.R4), RK3399 SDRAM Page (U?#3.M5)
DDR0_DQS2_N: LPDDR$_SDRAM_1 (U?#1.V3), RK3399 SDRAM Page (U?#3.V4)
DDR0_DQS2_P: LPDDR$_SDRAM_1 (U?#1.W3), RK3399 SDRAM Page (U?#3.U4)
DDR0_DQS3_N: LPDDR$_SDRAM_1 (U?#1.V10), RK3399 SDRAM Page (U?#3.R4)
DDR0_DQS3_P: LPDDR$_SDRAM_1 (U?#1.W10), RK3399 SDRAM Page (U?#3.P4)